# Altium project UPDATE.PrjPcb
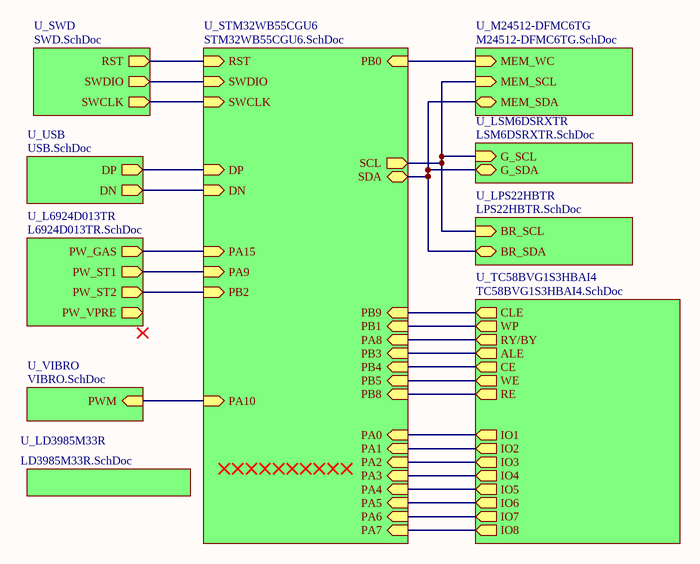
[diagram p0: Device.SchDoc]
11 sheets, 68 parts. Net scope: hierarchical (ports join the sheet entries above them; power ports are global).
Board files: Device.PcbDoc, PCBVer2.PcbDoc, PCBVer3.PcbDoc, PCBVer4.PcbDoc
Sheets:
  Device.SchDoc
    U_STM32WB55CGU6 = STM32WB55CGU6.SchDoc
    U_USB = USB.SchDoc
    U_L6924D013TR = L6924D013TR.SchDoc
    U_M24512-DFMC6TG = M24512-DFMC6TG.SchDoc
    U_LSM6DSRXTR = LSM6DSRXTR.SchDoc
    U_LPS22HBTR = LPS22HBTR.SchDoc
    U_VIBRO = VIBRO.SchDoc
    U_LD3985M33R = LD3985M33R.SchDoc
    U_TC58BVG1S3HBAI4 = TC58BVG1S3HBAI4.SchDoc
    U_SWD = SWD.SchDoc

## Sheet Device.SchDoc
size A4; SheetNumber: 1; SheetTotal: 11

### Sub-sheets
U_L6924D013TR = L6924D013TR.SchDoc: PW_GAS (out), PW_ST1 (out), PW_ST2 (out), PW_VPRE (out)
U_LD3985M33R = LD3985M33R.SchDoc: no entries
U_LPS22HBTR = LPS22HBTR.SchDoc: BR_SCL (in), BR_SDA (bidir)
U_LSM6DSRXTR = LSM6DSRXTR.SchDoc: G_SCL (in), G_SDA (bidir)
U_M24512-DFMC6TG = M24512-DFMC6TG.SchDoc: MEM_SDA (bidir), MEM_SCL (in), MEM_WC (in)
U_STM32WB55CGU6 = STM32WB55CGU6.SchDoc: SCL (out), SDA (bidir), DP (in), DN (in), RST (in), SWDIO (in), SWCLK (in), PA0 (in), PA1 (in), PA15 (in), PA7 (in), PB4 (in), PB3 (in), PA4 (in), PA5 (in), PA10 (in), PA6 (in), PA2 (in), PA3 (in), PB8 (in), PB9 (in), PB5 (in), PB1 (in), PB0 (in), PA8 (in), PA9 (in), PB2 (in)
U_SWD = SWD.SchDoc: RST (out), SWDIO (out), SWCLK (out)
U_TC58BVG1S3HBAI4 = TC58BVG1S3HBAI4.SchDoc: WP (out), ALE (out), CE (out), WE (out), RY/BY (out), RE (out), CLE (out), IO2 (out), IO3 (out), IO4 (out), IO5 (out), IO6 (out), IO7 (out), IO8 (out), IO1 (out)
U_USB = USB.SchDoc: DP (out), DN (out)
U_VIBRO = VIBRO.SchDoc: PWM (in)

### Nets
Net*_2: sheet U_STM32WB55CGU6/SWDIO, sheet U_SWD/SWDIO
Net*_3: sheet U_STM32WB55CGU6/SWCLK, sheet U_SWD/SWCLK
Net*_4: sheet U_STM32WB55CGU6/RST, sheet U_SWD/RST
NetC244_2: sheet U_STM32WB55CGU6/PA8, sheet U_TC58BVG1S3HBAI4/RY/BY
NetD1_1: sheet U_STM32WB55CGU6/PB2, sheet U_L6924D013TR/PW_ST2
NetD2_1: sheet U_STM32WB55CGU6/PA9, sheet U_L6924D013TR/PW_ST1
NetD44_1: sheet U_STM32WB55CGU6/DN, sheet U_USB/DN
NetD44_3: sheet U_STM32WB55CGU6/DP, sheet U_USB/DP
NetIC22_C3: sheet U_STM32WB55CGU6/PB1, sheet U_TC58BVG1S3HBAI4/WP
NetIC22_C4: sheet U_STM32WB55CGU6/PB3, sheet U_TC58BVG1S3HBAI4/ALE
NetIC22_C6: sheet U_STM32WB55CGU6/PB4, sheet U_TC58BVG1S3HBAI4/CE
NetIC22_C7: sheet U_STM32WB55CGU6/PB5, sheet U_TC58BVG1S3HBAI4/WE
NetIC22_D4: sheet U_STM32WB55CGU6/PB8, sheet U_TC58BVG1S3HBAI4/RE
NetIC22_D5: sheet U_STM32WB55CGU6/PB9, sheet U_TC58BVG1S3HBAI4/CLE
NetIC22_H4: sheet U_STM32WB55CGU6/PA0, sheet U_TC58BVG1S3HBAI4/IO1
NetIC22_J4: sheet U_STM32WB55CGU6/PA1, sheet U_TC58BVG1S3HBAI4/IO2
NetIC22_J7: sheet U_STM32WB55CGU6/PA5, sheet U_TC58BVG1S3HBAI4/IO6
NetIC22_J8: sheet U_STM32WB55CGU6/PA7, sheet U_TC58BVG1S3HBAI4/IO8
NetIC22_K4: sheet U_STM32WB55CGU6/PA2, sheet U_TC58BVG1S3HBAI4/IO3
NetIC22_K5: sheet U_STM32WB55CGU6/PA3, sheet U_TC58BVG1S3HBAI4/IO4
NetIC22_K6: sheet U_STM32WB55CGU6/PA4, sheet U_TC58BVG1S3HBAI4/IO5
NetIC22_K7: sheet U_STM32WB55CGU6/PA6, sheet U_TC58BVG1S3HBAI4/IO7
NetR2_1: sheet U_STM32WB55CGU6/PA15, sheet U_L6924D013TR/PW_GAS
NetR12_2: sheet U_STM32WB55CGU6/PA10, sheet U_VIBRO/PWM
NetR15_1: sheet U_STM32WB55CGU6/SCL, sheet U_M24512-DFMC6TG/MEM_SCL, sheet U_LSM6DSRXTR/G_SCL, sheet U_LPS22HBTR/BR_SCL
NetR16_1: sheet U_STM32WB55CGU6/SDA, sheet U_M24512-DFMC6TG/MEM_SDA, sheet U_LSM6DSRXTR/G_SDA, sheet U_LPS22HBTR/BR_SDA
NetU2_7: sheet U_STM32WB55CGU6/PB0, sheet U_M24512-DFMC6TG/MEM_WC

## Sheet STM32WB55CGU6.SchDoc
size A4; SheetNumber: 7; SheetTotal: 11
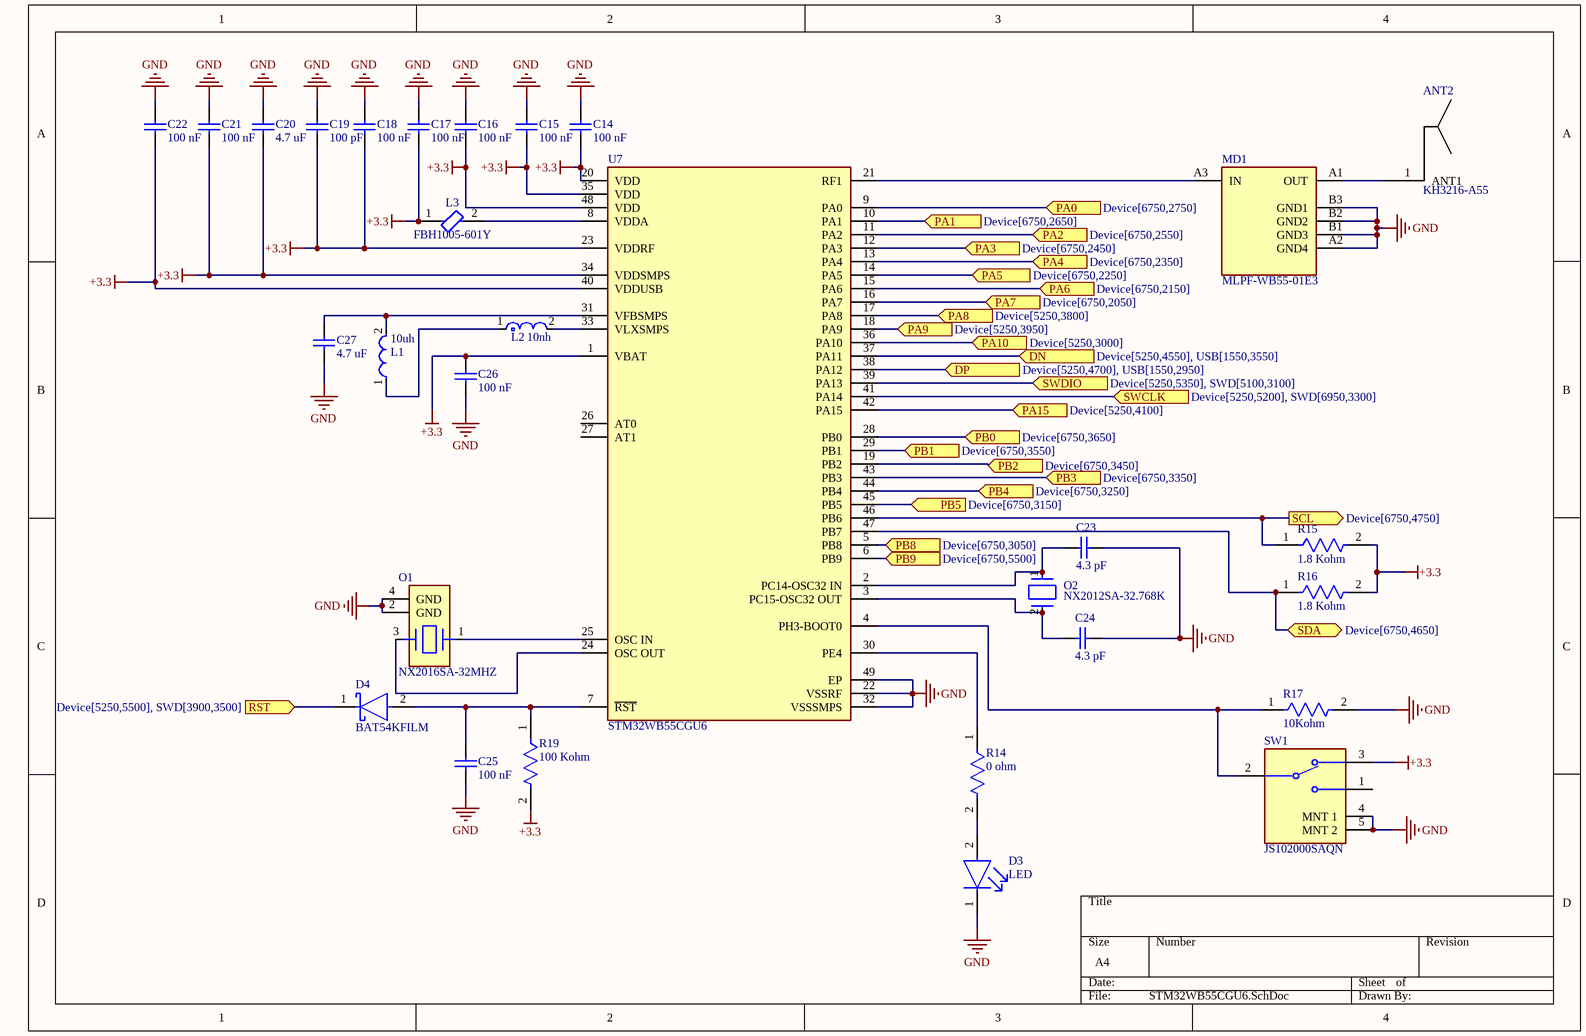
[diagram p1: STM32WB55CGU6.SchDoc]

### Parts
10uh  L1  [FP-LQW15DN_00-MFG]
ANT2  KH3216-A55  [KH3216-A55]
C14  100 nF  [CAPC1005X55X25NL05T10]
C15  100 nF  [CAPC1005X55X25NL05T10]
C16  100 nF  [CAPC1005X55X25NL05T10]
C17  100 nF  [CAPC1005X55X25NL05T10]
C18  100 nF  [CAPC1005X55X25NL05T10]
C19  100 pF  [CAPC1005X55X25NL05T10]
C20  4.7 uF  [CAPC1005X55X25NL05T10]
C21  100 nF  [CAPC1005X55X25NL05T10]
C22  100 nF  [CAPC1005X55X25NL05T10]
C23  4.3 pF  [CAPC1005X55X25NL05T10]
C24  4.3 pF  [CAPC1005X55X25NL05T10]
C25  100 nF  [CAPC1005X55X25NL05T10]
C26  100 nF  [CAPC1005X55X25NL05T10]
C27  4.7 uF  [CAPC1005X55X25NL05T10]
D3  LED  [FP-SML-P11MTT86-MFG]
D4  BAT54KFILM  [FP-SOD-523-MFG]
L2  10nh  [FP-LQG15WH_02-MFG]
L3  FBH1005-601Y  [FP-BLM15-0_05-MFG]
MD1  MLPF-WB55-01E3  [FP-MLPF-WB55-01E3-MFG]
O1  NX2016SA-32MHZ  [FP-NX2016SA-MFG]
O2  NX2012SA-32.768K  [FP-NX2012SA-MFG]
R14  0 ohm  [FP-RC1005-IPC_C]
R15  1.8 Kohm  [FP-RC1005-IPC_C]
R16  1.8 Kohm  [FP-RC1005-IPC_C]
R17  10Kohm  [FP-RC1005-IPC_C]
R19  100 Kohm  [FP-RC1005-IPC_C]
SW1  JS102000SAQN  [FP-JS102000SAQN-MFG]
U7  STM32WB55CGU6  [FP-STM32WB55CGU6-MFG]

### Ports
DN (in, see Device[5250,4550], USB[1550,3550]), DP (in, see Device[5250,4700], USB[1550,2950]), PA0 (in, see Device[6750,2750]), PA1 (in, see Device[6750,2650]), PA2 (in, see Device[6750,2550]), PA3 (in, see Device[6750,2450]), PA4 (in, see Device[6750,2350]), PA5 (in, see Device[6750,2250]), PA6 (in, see Device[6750,2150]), PA7 (in, see Device[6750,2050]), PA8 (in, see Device[5250,3800]), PA9 (in, see Device[5250,3950]), PA10 (in, see Device[5250,3000]), PA15 (in, see Device[5250,4100]), PB0 (in, see Device[6750,3650]), PB1 (in, see Device[6750,3550]), PB2 (in, see Device[6750,3450]), PB3 (in, see Device[6750,3350]), PB4 (in, see Device[6750,3250]), PB5 (in, see Device[6750,3150]), PB8 (in, see Device[6750,3050]), PB9 (in, see Device[6750,5500]), RST (in, see Device[5250,5500], SWD[3900,3500]), SCL (out, see Device[6750,4750]), SDA (bidir, see Device[6750,4650]), SWCLK (in, see Device[5250,5200], SWD[6950,3300]), SWDIO (in, see Device[5250,5350], SWD[5100,3100])

### Nets
+3.3: C14.1 C15.2 C16.1 C17.2 C18.1 C19.2 C20.2 C21.1 C22.2 C26.2 L3.1 R15.2 R16.2 R19.2 SW1.3 U7.1(VBAT) U7.20(VDD) U7.23(VDDRF) U7.34(VDDSMPS) U7.35(VDD) U7.40(VDDUSB) U7.48(VDD)
GND: C14.2 C15.1 C16.2 C17.1 C18.2 C19.1 C20.1 C21.2 C22.1 C23.2 C24.1 C25.1 C26.1 C27.2 D3.1(C) MD1.A2(GND4) MD1.B1(GND3) MD1.B2(GND2) MD1.B3(GND1) O1.2(GND) O1.4(GND) R17.2 SW1.4(MNT_1) SW1.5(MNT_2) U7.22(VSSRF) U7.32(VSSSMPS) U7.49(EP)
Net10uh_1: 10uh.1 L2.1
Net10uh_2: 10uh.2 C27.1 U7.31(VFBSMPS)
Net*_2: U7.39(PA13) ; port SWDIO
Net*_3: U7.41(PA14) ; port SWCLK
Net*_4: D4.1(C) ; port RST
NetANT2_1: ANT2.1(ANT1) MD1.A1(OUT)
NetC23_1: C23.1 O2.1 U7.2(PC14-OSC32_IN)
NetC24_2: C24.2 O2.2 U7.3(PC15-OSC32_OUT)
NetC25_2: C25.2 D4.2(A) R19.1 U7.7(~{RST})
NetC244_2: U7.17(PA8) ; port PA8
NetD1_1: U7.19(PB2) ; port PB2
NetD2_1: U7.18(PA9) ; port PA9
NetD3_2: D3.2(A) R14.2
NetD44_1: U7.37(PA11) ; port DN
NetD44_3: U7.38(PA12) ; port DP
NetIC22_C3: U7.29(PB1) ; port PB1
NetIC22_C4: U7.43(PB3) ; port PB3
NetIC22_C6: U7.44(PB4) ; port PB4
NetIC22_C7: U7.45(PB5) ; port PB5
NetIC22_D4: U7.5(PB8) ; port PB8
NetIC22_D5: U7.6(PB9) ; port PB9
NetIC22_H4: U7.9(PA0) ; port PA0
NetIC22_J4: U7.10(PA1) ; port PA1
NetIC22_J7: U7.14(PA5) ; port PA5
NetIC22_J8: U7.16(PA7) ; port PA7
NetIC22_K4: U7.11(PA2) ; port PA2
NetIC22_K5: U7.12(PA3) ; port PA3
NetIC22_K6: U7.13(PA4) ; port PA4
NetIC22_K7: U7.15(PA6) ; port PA6
NetL2_2: L2.2 U7.33(VLXSMPS)
NetL3_2: L3.2 U7.8(VDDA)
NetMD1_A3: MD1.A3(IN) U7.21(RF1)
NetO1_1: O1.1 U7.25(OSC_IN)
NetO1_3: O1.3 U7.24(OSC_OUT)
NetR2_1: U7.42(PA15) ; port PA15
NetR12_2: U7.36(PA10) ; port PA10
NetR14_1: R14.1 U7.30(PE4)
NetR15_1: R15.1 U7.46(PB6) ; port SCL
NetR16_1: R16.1 U7.47(PB7) ; port SDA
NetR17_1: R17.1 SW1.2(C) U7.4(PH3-BOOT0)
NetU2_7: U7.28(PB0) ; port PB0

Not connected (* = marked no-connect by the designer): SW1 1; U7 26(AT0) 27(AT1)

### Library data of the parts
10uh = CMP-06042-016523-1: FIXED IND 10UH 120MA 5.405OHM; RoHS Compliant: Yes
C14-C27 = CMP-2008-04515-1: Manufacturer: Murata; Part Number: GRM155F50J684ZE01D
D3 = CMP-2000-07126-2: LED YELLOW/GREEN CLEAR 1006 SMD; Forward Current: 20mA; Lens Color: Colorless; Power Rating: 54mW; Lens Style: Diffused; Wavelength: 569nm; Viewing Angle: 150°; Number of LEDs: 1; Test Current: 1mA; Luminous Intensity: 2.1mcd; Illumination Color: Green; Forward Voltage: 1.9V; REACH SVHC: No SVHC; Mount: Surface Mount; Series: PicoLED™; Case Code (Imperial): 0402; Min Operating Temperature: -40°C; Max Operating Temperature: 85°C; Number of Pins: 2; Package Quantity: 1; Height: 0.25mm; Lens Transparency: Clear; Case Code (Metric): 1005; Packaging: Tape and Reel; Width: 0.6mm; Radiation Hardening: No; Case/Package: 0402; Lead Free: Lead Free; Color: Green; RoHS Compliant: Yes; Length: 1mm; Dominant Wavelength: 569nm
D4 = CMP-12187-000026-1: DIODE SCHOTTKY 40V 300MA SOD523; Manufacturer: STMicroelectronics; Capacitance: 7pF; Value: 7pF; Max Surge Forward Current: 1.25A; Peak Reverse Current: 1uA; Max Junction Temp: +150°C; Device Class L2: Diodes; Temperature Range Low: -40°C; Category: Diode; Manufacturer Part Number: BAT54KFILM; Digikey Description: DIODE SCHOTTKY 40V 300MA SOD523; Device Class L3: Schottky Diodes; Automotive: No; Height: 0.7mm; Octopart: https://octopart.com/bat54kfilm-stmicroelectronics-39618022; ComponentLink2Description: Datasheet; Temperature Range High: +150°C; Device Class L1: Discrete Semiconductors; Max Repetitive Reverse Voltage: 40V; RoHS: TRUE; Temperature: -40°C to +150°C; ComponentLink2URL: https://www.st.com/content/ccc/resource/technical/document/datasheet/07/50/54/f2/0d/ba/4a/79/CD00001322.pdf/files/CD00001322.pdf/jcr:content/translations/en.CD00001322.pdf; Lead Free: Yes; Forward Current: 300mA; Package: SOD-523; Mouser Description: Schottky Diodes & Rectifiers schottky diode
L2 = CMP-06042-005237-1: Multilayer type Inductor for Automotive 10nH ±5% 0.19Ω 500mA 0402; Core Material: Air; Test Frequency: 100MHz; DC Resistance (DCR): 190mR; Shielding: Unshielded; Self Resonant Frequency: 3.3GHz; Min Operating Temperature: -55°C; Tolerance: 5%; Inductance: 10nH; Max Operating Temperature: 125°C; Packaging: Cut Tape; Current Rating: 500mA; Case Code (Metric): 1005; Mount: Surface Mount; Case/Package: 0402; Ratings: AEC-Q200; Case Code (Imperial): 0402
L3 = CMP-0686-00187-4: Chip Ferrite Bead, 0402, 600Ω @ 100MHz, 0.52Ω, 25%, 300mA; DC Resistance-Max: 600mR; Number of Lines: 1; DC Resistance (DCR): 520mR; Shielding: Unshielded; Impedance: 600R; Material: Steel; Frequency: 100MHz; Lead Free: Lead Free; Max DC Current: 300mA; Test Frequency: 100MHz; Depth: 0.55mm; Length: 1mm; Case Code (Imperial): 0402; Packaging: Tape and Reel; Height: 0.5mm; Max Operating Temperature: 125°C; Military Standard: Not; REACH SVHC: No SVHC; Case Code (Metric): 1005; Series: BLM15AG_SN; Core Material: Ferrite; Termination: SMD/SMT; DC Current: 300mA; Package Quantity: 10000; Width: 0.5mm; RoHS Compliant: Yes; Min Operating Temperature: -55°C; Current Rating: 300mA; Case/Package: 0402; Number of Pins: 2; Radiation Hardening: No; Tolerance: 25%; Number of Circuits: 1; Max Current Rating: 300mA
MD1 = CMP-12074-000002-1: RF FILTER LOW PASS 2.45GHZ 6SMD
O1 = CMP-200220-000017-1: CRYSTAL 32.0000MHZ 8PF SMD; Frequency: 32MHz; ESR (Equivalent Series Resistance): 60R; Ratings: AEC-Q200; Mount: Surface Mount; Case/Package: SMD/SMT; Packaging: Tape and Reel; Load Capacitance: 8pF; Min Operating Temperature: -40°C; Max Operating Temperature: 125°C
O2 = CMP-200220-000019-1: CRYSTAL 32.7680KHZ 12.5PF SMD; Frequency Tolerance: 20ppm; ESR (Equivalent Series Resistance): 80kR; Frequency: 32.768kHz; Mount: Surface Mount; Packaging: Cut Tape; Min Operating Temperature: -40°C; Max Operating Temperature: 85°C; Case/Package: SMD/SMT; RoHS Compliant: Yes; Length: 0.081inch; Series: NX2012SA; Height: 0.024inch; Width: 0.047inch; Load Capacitance: 12.5pF
R14-R17 R19 = CMP-13261-000953-1: Res Thick Film 0402 1.87kΩ 1% 0.063W ±100ppm/°C Molded SMD T/R; Power Rating: 63mW; Voltage Rating (DC): 50V; Resistance: 1.87kR; Tolerance: 1%; Height: 0.016inch; Length: 1mm; Case Code (Metric): 1005; Width: 0.02inch; Max Power Dissipation: 63mW; Radiation Hardening: No; Features: Moisture Resistant; Temperature Coefficient: 100ppm/°C; Min Operating Temperature: -55°C; Number of Terminations: 2; Max Operating Temperature: 155°C; Case Code (Imperial): 0402; Composition: Thick Film; Depth: 0.5mm; Lead Free: Lead Free; Package Quantity: 1; Case/Package: 0402; Packaging: Tape and Reel; Contact Plating: Tin; Military Standard: Not
SW1 = CMP-10038-000025-1: SWITCH SLIDE SPDT 1MA 5V; Actuator Material: Nylon; Contact Resistance: 70mR; Electrical Life: 15000Cycles; Actuator Length: 1.5mm; Switch Function: On-On; Actuator Type: Standard; Actuator Color: Black; Current Rating: 1mA; Throw Configuration: SPDT; Termination: Gull Wing; Housing Material: Nylon; Max Operating Temperature: 85°C; Max Voltage Rating (DC): 5V; Voltage Rating (DC): 5V; Contact Plating: Silver; Radiation Hardening: No; Package Quantity: 1; REACH SVHC: No SVHC; RoHS Compliant: Yes; Orientation: Right Angle; Max Current Rating: 1mA; Case/Package: SMD/SMT; Contact Current Rating: 1mA; Contact Material: Copper Alloy; Mount: Surface Mount; Flammability Rating: UL94 V-2; Packaging: Tape and Reel; Switch Travel: 1.5mm; Length: 7.8mm; Series: JS; Min Operating Temperature: -20°C; Depth: 4.82mm
U7 = CMP-12105-000013-1: ULTRA-LOW-POWER DUAL CORE ARM CO; Manufacturer: STMicroelectronics; Number Of Cores: 1; Number Of I2C Channels: 2; Interface: I2C,SPI,UART,USART,2-Wire,USB,IrDA,Other; Core Architecture: ARM Cortex-M4; Data Bus Width: 32bits; Memory Size: 1MBytes; Number Of Pwm Channels: 14; Max Supply Voltage: 3.6V; Standoff Height: 0mm; Number Of Timers/Counters: 6; Frequency: 64MHz; Max Junction Temp: +105°C; Number Of I/Os: 30; Min Supply Voltage: 1.71V; Number Of Adc Channels: 13; Ram Size: 256KBytes; Memory Type: FLASH; Octopart: https://octopart.com/stm32wb55cgu6-stmicroelectronics-98750847; Temperature Range High: +105°C; RoHS: TRUE; Number Of Spi Channels: 1; Category: IC; Device Class L1: Integrated Circuits (ICs); Lead Free: Yes; Height: 0.65mm; Number Of A/D Converters: 1; Package: UFQFPN48; Number Of Usb Channels: 1; Number Of Uart Channels: 2; Temperature Range Low: -40°C; Ambient Temperature Range Low: -40°C; Device Class L3: Microcontrollers; Manufacturer Part Number: STM32WB55CGU6; Temperature: -40°C to +105°C; ComponentLink2URL: https://www.st.com/resource/en/datasheet/stm32wb55cg.pdf; Device Class L2: Embedded Processors and Controllers; Digikey Description: ULTRA-LOW-POWER DUAL CORE ARM CO; ComponentLink2Description: Datasheet; Ambient Temperature Range High: +85°C; Automotive: No

## Sheet USB.SchDoc
size A4; SheetNumber: 9; SheetTotal: 11
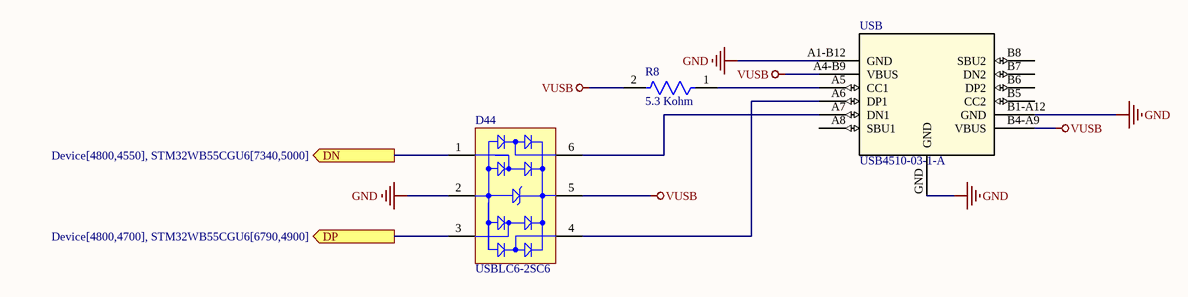
[diagram p2: USB.SchDoc]

### Parts
D44  USBLC6-2SC6  [STM-SOT23-6L_V]
R8  5.3 Kohm  [FP-RC1005-IPC_C]
USB  USB4510-03-1-A  [USB4510-03-1-A]

### Ports
DN (out, see Device[4800,4550], STM32WB55CGU6[7340,5000]), DP (out, see Device[4800,4700], STM32WB55CGU6[6790,4900])

### Nets
GND: D44.2(GND) USB.A1-B12(GND) USB.B1-A12(GND) USB.GND
VUSB: D44.5(VBUS) R8.2 USB.A4-B9(VBUS) USB.B4-A9(VBUS)
NetD44_1: D44.1(I/O_1) ; port DN
NetD44_3: D44.3(I/O_2) ; port DP
NetD44_4: D44.4(I/O_3) USB.A6(DP1)
NetD44_6: D44.6(I/O_4) USB.A7(DN1)
NetR8_1: R8.1 USB.A5(CC1)

Not connected (* = marked no-connect by the designer): USB A8(SBU1) B5(CC2) B6(DP2) B7(DN2) B8(SBU2)

### Library data of the parts
D44 = CMP-2000-05378-1: Very low capacitance ESD protection, 3.5 pF, -40 to 125 degC, 6-Pin SOT23, RoHS, Tape and Reel; Manufacturer: STMicroelectronics; Polarity: Uni-Directional; Clamping Voltage: 17V; Rad Hardened: No; Product Height (mm): 1.3mm; Leakage Current (Max): 0.15uA; Product Length (mm): 3.05mm; Number of Elements: 1; Peak Pulse Current: 5A; Configuration: Dual; Reverse Breakdown Voltage: 6V; Working Voltage (Max): 5V; Capacitance Value: 3.5pF; Suppressor Type: DiodeArrays; Product Depth (mm): 1.75mm; Test Current (It): 1mA; Package / Case: SOT-23; Operating Temperature Max Deg. C: 125C; Package Description: 6-Pin Small Outline Transistor, Body 2.925 x 1.625 mm, Pitch 0.95 mm; Package Reference: SOT23-6L; Datasheet Version: Rev. 5, 10/2011; Operating Temperature Min Deg. C: -40C; Mounting Style: SurfaceMount; Direction Type: Uni-Directional; Mounting: SurfaceMount; Pin Count: 6; Leakage Current: 0.15uA; Packaging: TapeandReel; Operating Temperature Classification: Automotive; Clamping Voltage (Max): 17V; Manufacturer URL: http://www.st.com/; Reverse Stand-off Voltage: 5V; Datasheet URL: http://www.st.com/st-web-ui/static/active/en/resource/technical/document/datasheet/CD00050750.pdf; Working Voltage: 5V; Operating Temp Range: -40Cto125C
R8 = CMP-13261-000953-1: as R14 on sheet STM32WB55CGU6; Tolerance: 1%; Height: 0.016inch; Length: 1mm; Case Code (Metric): 1005; Width: 0.02inch; Max Power Dissipation: 63mW; Radiation Hardening: No; Features: Moisture Resistant; Temperature Coefficient: 100ppm/°C; Min Operating Temperature: -55°C; Number of Terminations: 2; Max Operating Temperature: 155°C; Case Code (Imperial): 0402; Composition: Thick Film; Depth: 0.5mm; Lead Free: Lead Free; Package Quantity: 1; Case/Package: 0402; Packaging: Tape and Reel; Contact Plating: Tin; Military Standard: Not

## Sheet L6924D013TR.SchDoc
size A4; SheetNumber: 2; SheetTotal: 11
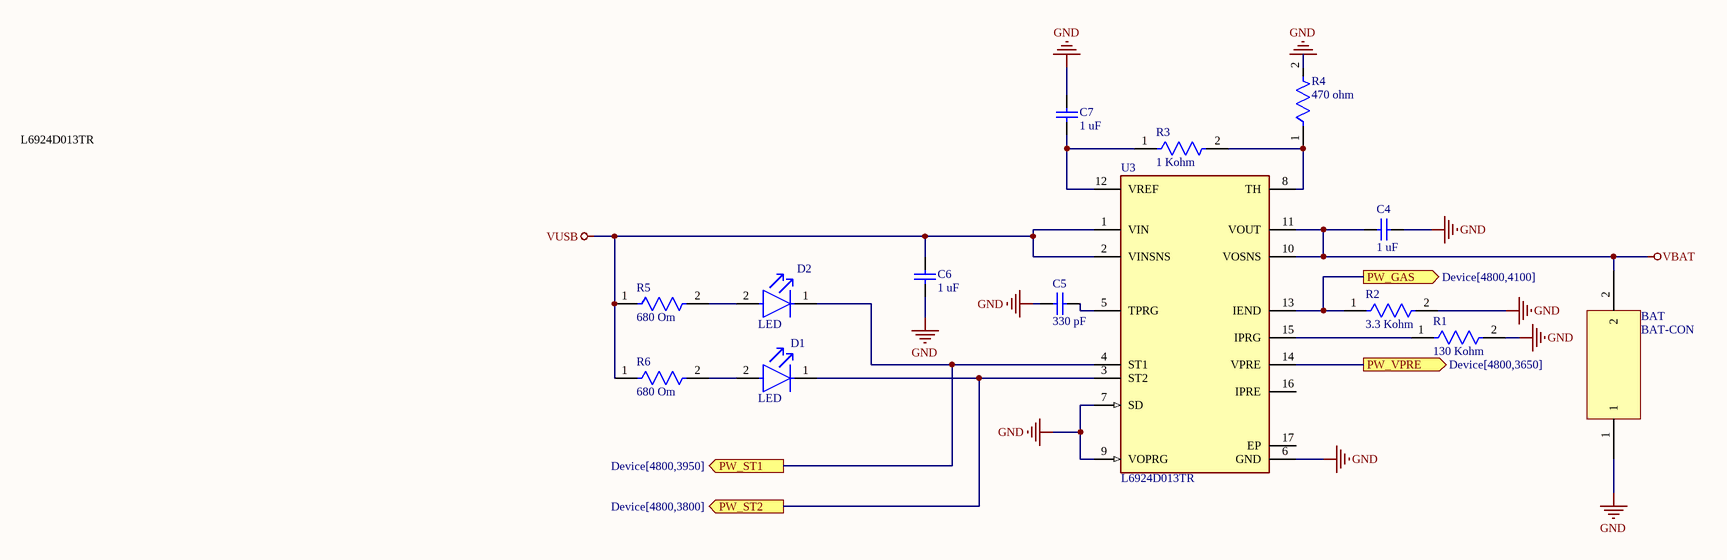
[diagram p3: L6924D013TR.SchDoc]

### Parts
BAT  BAT-CON  [BAT-CON]
C4  1 uF  [CAPC1005X55X25NL05T10]
C5  330 pF  [CAPC1005X55X25NL05T10]
C6  1 uF  [CAPC1005X55X25NL05T10]
C7  1 uF  [CAPC1005X55X25NL05T10]
D1  LED  [FP-SML-P11MTT86-MFG]
D2  LED  [FP-SML-P11MTT86-MFG]
R1  130 Kohm  [FP-RC1005-IPC_C]
R2  3.3 Kohm  [FP-RC1005-IPC_C]
R3  1 Kohm  [FP-RC1005-IPC_C]
R4  470 ohm  [FP-RC1005-IPC_C]
R5  680 Om  [FP-RC1005-IPC_C]
R6  680 Om  [FP-RC1005-IPC_C]
U3  L6924D013TR  [FP-VFQFPN16-7185330-MFG]

### Ports
PW_GAS (out, see Device[4800,4100]), PW_ST1 (out, see Device[4800,3950]), PW_ST2 (out, see Device[4800,3800]), PW_VPRE (out, see Device[4800,3650])

### Nets
GND: BAT.1 C4.1 C5.2 C6.2 C7.1 R1.2 R2.2 R4.2 U3.6(GND) U3.7(SD) U3.9(VOPRG)
VBAT: BAT.2 C4.2 U3.10(VOSNS) U3.11(VOUT)
VUSB: C6.1 R5.1 R6.1 U3.1(VIN) U3.2(VINSNS)
NetC5_1: C5.1 U3.5(TPRG)
NetC7_2: C7.2 R3.1 U3.12(VREF)
NetD1_1: D1.1(C) U3.3(ST2) ; port PW_ST2
NetD1_2: D1.2(A) R6.2
NetD2_1: D2.1(C) U3.4(ST1) ; port PW_ST1
NetD2_2: D2.2(A) R5.2
NetR1_1: R1.1 U3.15(IPRG)
NetR2_1: R2.1 U3.13(IEND) ; port PW_GAS
NetR3_2: R3.2 R4.1 U3.8(TH)
NetU3_14: U3.14(VPRE) ; port PW_VPRE

Not connected (* = marked no-connect by the designer): U3 16(IPRE) 17(EP)

### Notes on the sheet
- L6924D013TR

### Library data of the parts
C4-C7 = CMP-2008-04515-1: as C14 on sheet STM32WB55CGU6
D1 D2 = CMP-2000-07126-2: as D3 on sheet STM32WB55CGU6; REACH SVHC: No SVHC; Mount: Surface Mount; Series: PicoLED™; Case Code (Imperial): 0402; Min Operating Temperature: -40°C; Max Operating Temperature: 85°C; Number of Pins: 2; Package Quantity: 1; Height: 0.25mm; Lens Transparency: Clear; Case Code (Metric): 1005; Packaging: Tape and Reel; Width: 0.6mm; Radiation Hardening: No; Case/Package: 0402; Lead Free: Lead Free; Color: Green; RoHS Compliant: Yes; Length: 1mm; Dominant Wavelength: 569nm
R1-R6 = CMP-13261-000953-1: as R14 on sheet STM32WB55CGU6; Tolerance: 1%; Height: 0.016inch; Length: 1mm; Case Code (Metric): 1005; Width: 0.02inch; Max Power Dissipation: 63mW; Radiation Hardening: No; Features: Moisture Resistant; Temperature Coefficient: 100ppm/°C; Min Operating Temperature: -55°C; Number of Terminations: 2; Max Operating Temperature: 155°C; Case Code (Imperial): 0402; Composition: Thick Film; Depth: 0.5mm; Lead Free: Lead Free; Package Quantity: 1; Case/Package: 0402; Packaging: Tape and Reel; Contact Plating: Tin; Military Standard: Not
U3 = CMP-12147-000005-1: IC BATT CHRGR ION/POLY 16-VFQFPN; Manufacturer: STMicroelectronics; Output Current: 975mA; Number Of Cells: 1; Standoff Height: 0.02mm; Max Junction Temp: +125°C; Max Supply Voltage: 12V; Nominal Supply Current: 1.8mA; Max Power Dissipation: 0.67W; Min Supply Voltage: 2.5V; Output Voltage: 4.2V; Automotive: No; Manufacturer Part Number: L6924D013TR; Digikey Description: IC BATT CHRGR ION/POLY 16-VFQFPN; ComponentLink2Description: Datasheet; Footprint Url: https://www.st.com/resource/en/datasheet/l6738.pdf; Device Class L2: Power Management ICs; Package: VFQFPN16-7185330; Temperature Range High: +125°C; Mouser Description: Battery Management Battery Charger Sys Li-Ion/Li-Poly; Number Of Outputs: 1; Lead Free: Yes; Device Class L3: Battery Management; Category: IC; Temperature: -40°C to +125°C; Temperature Range Low: -40°C; Octopart: https://octopart.com/l6924d013tr-stmicroelectronics-421996; ComponentLink2URL: https://www.st.com/resource/en/datasheet/l6924d.pdf; Device Class L1: Integrated Circuits (ICs); Height: 1mm; Ipc Land Pattern Name: QFN50P300X300X90-16; RoHS: TRUE

## Sheet M24512-DFMC6TG.SchDoc
size A4; SheetNumber: 6; SheetTotal: 11
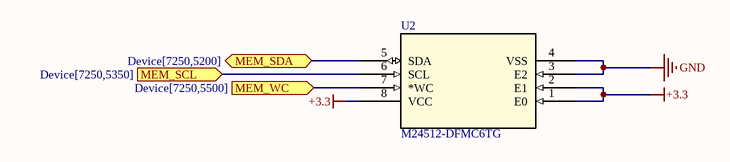
[diagram p4: M24512-DFMC6TG.SchDoc]

### Parts
U2  M24512-DFMC6TG  [M24512-DFMC6TG]

### Ports
MEM_SCL (in, see Device[7250,5350]), MEM_SDA (bidir, see Device[7250,5200]), MEM_WC (in, see Device[7250,5500])

### Nets
+3.3: U2.1(E0) U2.2(E1) U2.8(VCC)
GND: U2.3(E2) U2.4(VSS)
NetR15_1: U2.6(SCL) ; port MEM_SCL
NetR16_1: U2.5(SDA) ; port MEM_SDA
NetU2_7: U2.7(*WC) ; port MEM_WC

## Sheet LSM6DSRXTR.SchDoc
size A4; SheetNumber: 5; SheetTotal: 11
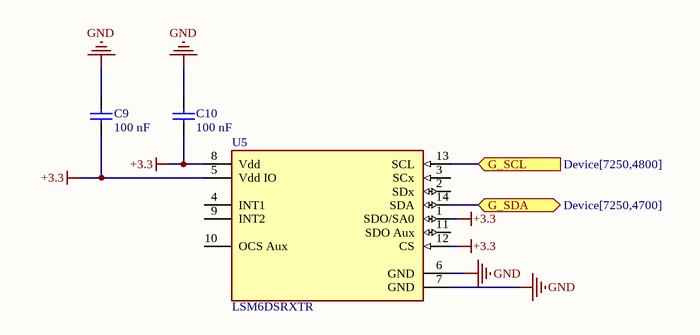
[diagram p5: LSM6DSRXTR.SchDoc]

### Parts
C9  100 nF  [CAPC1005X55X25NL05T10]
C10  100 nF  [CAPC1005X55X25NL05T10]
U5  LSM6DSRXTR  [FP-LGA-14L-DM00249496-MFG]

### Ports
G_SCL (in, see Device[7250,4800]), G_SDA (bidir, see Device[7250,4700])

### Nets
+3.3: C9.2 C10.2 U5.1(SDO/SA0) U5.5(Vdd_IO) U5.8(Vdd) U5.12(CS)
GND: C9.1 C10.1 U5.6(GND) U5.7(GND)
NetR15_1: U5.13(SCL) ; port G_SCL
NetR16_1: U5.14(SDA) ; port G_SDA

Not connected (* = marked no-connect by the designer): U5 2(SDx) 3(SCx) 4(INT1) 9(INT2) 10(OCS_Aux) 11(SDO_Aux)

### Library data of the parts
C9 C10 = CMP-2008-04515-1: as C14 on sheet STM32WB55CGU6
U5 = CMP-12177-000016-1: CONSUMER MEMS; RoHS Compliant: Yes

## Sheet LPS22HBTR.SchDoc
size A4; SheetNumber: 4; SheetTotal: 11
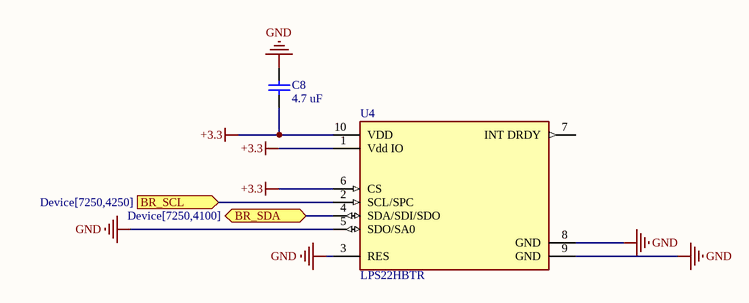
[diagram p6: LPS22HBTR.SchDoc]

### Parts
C8  4.7 uF  [CAPC1005X55X25NL05T10]
U4  LPS22HBTR  [FP-HLGA-10L-8479831-0]

### Ports
BR_SCL (in, see Device[7250,4250]), BR_SDA (bidir, see Device[7250,4100])

### Nets
+3.3: C8.2 U4.1(Vdd_IO) U4.6(CS) U4.10(VDD)
GND: C8.1 U4.3(RES) U4.5(SDO/SA0) U4.8(GND) U4.9(GND)
NetR15_1: U4.2(SCL/SPC) ; port BR_SCL
NetR16_1: U4.4(SDA/SDI/SDO) ; port BR_SDA

Not connected (* = marked no-connect by the designer): U4 7(INT_DRDY)

### Library data of the parts
C8 = CMP-2008-04515-1: as C14 on sheet STM32WB55CGU6
U4 = CMP-12182-000004-1: MEMS NANO PRESSURE SENSOR: 260-1; Manufacturer: STMicroelectronics; Sensor Output: I2C,SPI; Port Style: No Port; Max Supply Voltage: 3.6V; Operating Supply Current: 3-12uA; Min Supply Voltage: 1.7V; Device Class L3: unset; Device Class L1: Sensors; Manufacturer Part Number: LPS22HBTR; Temperature Range High: +85°C; Digikey Description: MEMS NANO PRESSURE SENSOR: 260-1; Device Class L2: Pressure Sensors; RoHS: TRUE; Lead Free: Yes; Height: 0.8mm; Automotive: No; Octopart: https://octopart.com/lps22hbtr-stmicroelectronics-51851131; Package: HLGA-10L-8479831; Temperature Range Low: -40°C; Category: IC; Temperature: -40°C to +85°C; ComponentLink2Description: Datasheet; ComponentLink2URL: https://www.st.com/resource/en/datasheet/lps22hb.pdf; Footprint Url: https://www.st.com/content/ccc/resource/technical/document/technical_note/73/17/9c/16/dd/96/4a/01/CD00134799.pdf/files/CD00134799.pdf/jcr:content/translations/en.CD00134799.pdf

## Sheet VIBRO.SchDoc
size A4; SheetNumber: 10; SheetTotal: 11
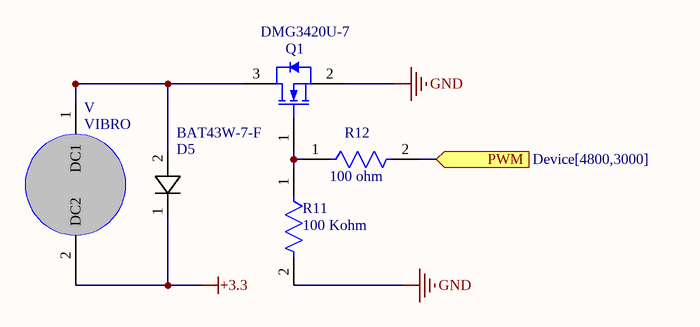
[diagram p7: VIBRO.SchDoc]

### Parts
D5  BAT43W-7-F  [BAT43W-7-F]
Q1  DMG3420U-7  [DIOD-SOT23-3_B_V]
R11  100 Kohm  [FP-RC1005-IPC_C]
R12  100 ohm  [FP-RC1005-IPC_C]
V  VIBRO  [VIBRO]

### Ports
PWM (in, see Device[4800,3000])

### Nets
+3.3: D5.1 V.2(DC2)
GND: Q1.2(S) R11.2
NetD5_2: D5.2 Q1.3(D) V.1(DC1)
NetQ1_1: Q1.1(G) R11.1 R12.1
NetR12_2: R12.2 ; port PWM

### Library data of the parts
Q1 = CMP-2000-06172-1: N-Channel Enhancement Mode MOSFET, 20 V, -55 to 150 degC, 3-Pin SOT23, RoHS, Tape and Reel; Manufacturer: Diodes Inc; Drain-Source On Resistance-Max: 29mO; Qg Gate Charge: 5.4nC; Drain-to-Source Voltage [Vdss]: 20V; Rated Power Dissipation: 740mW; Datasheet URL: http://www.diodes.com/_files/datasheets/ds31867.pdf; Package Description: 3-Pin Small Outline Transistor, Body 2.9 x 1.3 mm, Pitch 0.96 mm; Package Reference: SOT23-3; Datasheet Version: Rev. 5-2, 09/2013; Mounting Technology: SurfaceMount; Channel Type: N-Channel; Manufacturer URL: http://www.diodes.com/
R11 R12 = CMP-13261-000953-1: as R14 on sheet STM32WB55CGU6; Tolerance: 1%; Height: 0.016inch; Length: 1mm; Case Code (Metric): 1005; Width: 0.02inch; Max Power Dissipation: 63mW; Radiation Hardening: No; Features: Moisture Resistant; Temperature Coefficient: 100ppm/°C; Min Operating Temperature: -55°C; Number of Terminations: 2; Max Operating Temperature: 155°C; Case Code (Imperial): 0402; Composition: Thick Film; Depth: 0.5mm; Lead Free: Lead Free; Package Quantity: 1; Case/Package: 0402; Packaging: Tape and Reel; Contact Plating: Tin; Military Standard: Not

## Sheet LD3985M33R.SchDoc
size A4; SheetNumber: 3; SheetTotal: 11
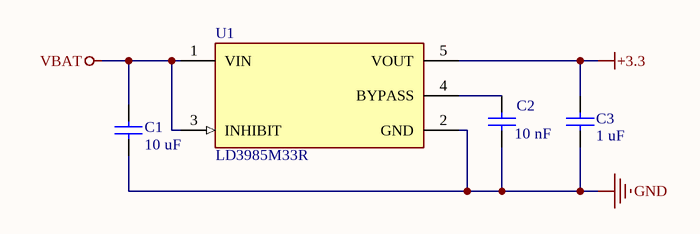
[diagram p8: LD3985M33R.SchDoc]

### Parts
C1  10 uF  [CAPC1005X55X25NL05T10]
C2  10 nF  [CAPC1005X55X25NL05T10]
C3  1 uF  [CAPC1005X55X25NL05T10]
U1  LD3985M33R  [FP-SOT23-5L-7049676-MFG]

### Nets
+3.3: C3.2 U1.5(VOUT)
GND: C1.1 C2.1 C3.1 U1.2(GND)
VBAT: C1.2 U1.1(VIN) U1.3(INHIBIT)
NetC2_2: C2.2 U1.4(BYPASS)

### Library data of the parts
C1-C3 = CMP-2008-04515-1: as C14 on sheet STM32WB55CGU6
U1 = CMP-0244-00328-2: IC REG LINEAR 3.3V 150MA SOT23-5; Input Bias Current: 85uA; Output Type: Fixed; Max Input Voltage: 6V; Min Input Voltage: 2.5V; Output Voltage Accuracy: 2%; Quiescent Current: 150uA; Number of Regulators: 1; Min Current Limit: 300mA; Dropout Voltage: 60mV; Polarity: Positive; Min Operating Temperature: -40°C; Height: 1.3mm; Radiation Hardening: No; Package Quantity: 1; Number of Pins: 5; Output Current: 150mA; Width: 1.75mm; Length: 3mm; Mount: Surface Mount; Case/Package: SOT-23; Lead Free: Lead Free; Number of Outputs: 1; Max Operating Temperature: 125°C; Accuracy: 2%; Max Output Current: 150mA; Packaging: Tape and Reel; Output Voltage: 3.3V; Min Output Voltage: 3.3V

## Sheet TC58BVG1S3HBAI4.SchDoc
size A4; SheetNumber: 11; SheetTotal: 11
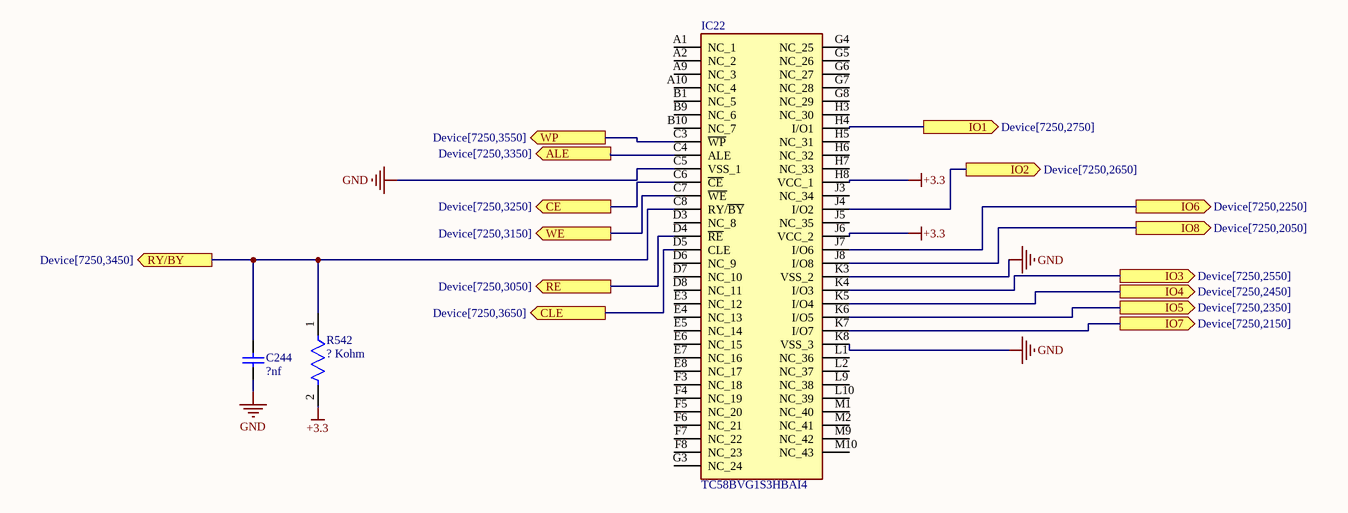
[diagram p9: TC58BVG1S3HBAI4.SchDoc]

### Parts
C244  ?nf  [CAPC1005X55X25NL05T10]
IC22  TC58BVG1S3HBAI4  [BGA63C80P10X12_900X1100X100]
R542  ? Kohm  [FP-RC1005-IPC_C]

### Ports
ALE (out, see Device[7250,3350]), CE (out, see Device[7250,3250]), CLE (out, see Device[7250,3650]), IO1 (out, see Device[7250,2750]), IO2 (out, see Device[7250,2650]), IO3 (out, see Device[7250,2550]), IO4 (out, see Device[7250,2450]), IO5 (out, see Device[7250,2350]), IO6 (out, see Device[7250,2250]), IO7 (out, see Device[7250,2150]), IO8 (out, see Device[7250,2050]), RE (out, see Device[7250,3050]), RY/BY (out, see Device[7250,3450]), WE (out, see Device[7250,3150]), WP (out, see Device[7250,3550])

### Nets
+3.3: IC22.H8(VCC_1) IC22.J6(VCC_2) R542.2
GND: C244.1 IC22.C5(VSS_1) IC22.K3(VSS_2) IC22.K8(VSS_3)
NetC244_2: C244.2 IC22.C8(RY/~{BY}) R542.1 ; port RY/BY
NetIC22_C3: IC22.C3(~{WP}) ; port WP
NetIC22_C4: IC22.C4(ALE) ; port ALE
NetIC22_C6: IC22.C6(~{CE}) ; port CE
NetIC22_C7: IC22.C7(~{WE}) ; port WE
NetIC22_D4: IC22.D4(~{RE}) ; port RE
NetIC22_D5: IC22.D5(CLE) ; port CLE
NetIC22_H4: IC22.H4(I/O1) ; port IO1
NetIC22_J4: IC22.J4(I/O2) ; port IO2
NetIC22_J7: IC22.J7(I/O6) ; port IO6
NetIC22_J8: IC22.J8(I/O8) ; port IO8
NetIC22_K4: IC22.K4(I/O3) ; port IO3
NetIC22_K5: IC22.K5(I/O4) ; port IO4
NetIC22_K6: IC22.K6(I/O5) ; port IO5
NetIC22_K7: IC22.K7(I/O7) ; port IO7

Not connected (* = marked no-connect by the designer): IC22 A1(NC_1) A2(NC_2) A9(NC_3) A10(NC_4) B1(NC_5) B9(NC_6) B10(NC_7) D3(NC_8) D6(NC_9) D7(NC_10) D8(NC_11) E3(NC_12) E4(NC_13) E5(NC_14) E6(NC_15) E7(NC_16) E8(NC_17) F3(NC_18) F4(NC_19) F5(NC_20) F6(NC_21) F7(NC_22) F8(NC_23) G3(NC_24) G4(NC_25) G5(NC_26) G6(NC_27) G7(NC_28) G8(NC_29) H3(NC_30) H5(NC_31) H6(NC_32) H7(NC_33) J3(NC_34) J5(NC_35) L1(NC_36) L2(NC_37) L9(NC_38) L10(NC_39) M1(NC_40) M2(NC_41) M9(NC_42) M10(NC_43)

### Library data of the parts
C244 = CMP-2008-04515-1: as C14 on sheet STM32WB55CGU6
IC22 = TC58BVG1S3HBAI4: Integrated Circuit; Manufacturer_Name: Toshiba; Datasheet Link: https://media.digikey.com/pdf/Data%20Sheets/Toshiba%20PDFs/KIOXIA_TC58BVG1S3HBAI4_REV2.00_E20191001C.pdf; Height: 1mm; Manufacturer_Part_Number: TC58BVG1S3HBAI4; Mouser Part Number: 757-TC58BVG1S3HBAI4; Mouser Price/Stock: https://www.mouser.com/Search/Refine.aspx?Keyword=757-TC58BVG1S3HBAI4
R542 = CMP-13261-000953-1: as R14 on sheet STM32WB55CGU6; Tolerance: 1%; Height: 0.016inch; Length: 1mm; Case Code (Metric): 1005; Width: 0.02inch; Max Power Dissipation: 63mW; Radiation Hardening: No; Features: Moisture Resistant; Temperature Coefficient: 100ppm/°C; Min Operating Temperature: -55°C; Number of Terminations: 2; Max Operating Temperature: 155°C; Case Code (Imperial): 0402; Composition: Thick Film; Depth: 0.5mm; Lead Free: Lead Free; Package Quantity: 1; Case/Package: 0402; Packaging: Tape and Reel; Contact Plating: Tin; Military Standard: Not

## Sheet SWD.SchDoc
size A4; SheetNumber: 8; SheetTotal: 11
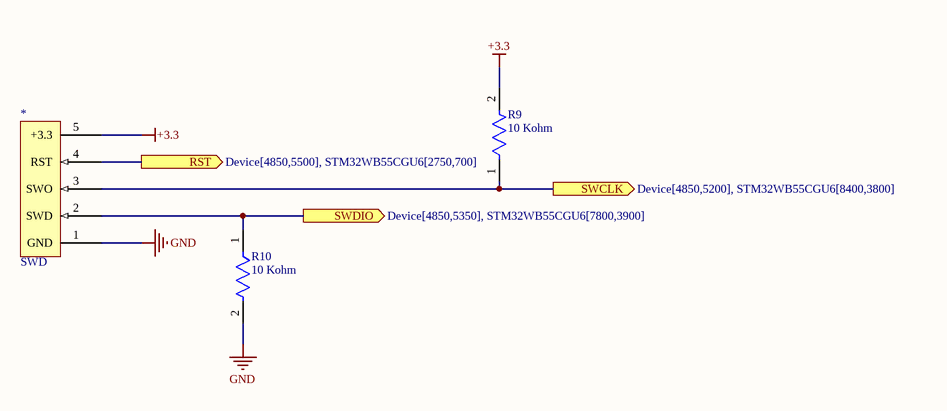
[diagram p10: SWD.SchDoc]

### Parts
*  SWD  [PCBComponent_1]
R9  10 Kohm  [FP-RC1005-IPC_C]
R10  10 Kohm  [FP-RC1005-IPC_C]

### Ports
RST (out, see Device[4850,5500], STM32WB55CGU6[2750,700]), SWCLK (out, see Device[4850,5200], STM32WB55CGU6[8400,3800]), SWDIO (out, see Device[4850,5350], STM32WB55CGU6[7800,3900])

### Nets
+3.3: *.5(+3.3) R9.2
GND: *.1(GND) R10.2
Net*_2: *.2(SWD) R10.1 ; port SWDIO
Net*_3: *.3(SWO) R9.1 ; port SWCLK
Net*_4: *.4(RST) ; port RST

### Library data of the parts
* = SWD: pin to pad: 4>5 5>4
R9 R10 = CMP-13261-000953-1: as R14 on sheet STM32WB55CGU6; Tolerance: 1%; Height: 0.016inch; Length: 1mm; Case Code (Metric): 1005; Width: 0.02inch; Max Power Dissipation: 63mW; Radiation Hardening: No; Features: Moisture Resistant; Temperature Coefficient: 100ppm/°C; Min Operating Temperature: -55°C; Number of Terminations: 2; Max Operating Temperature: 155°C; Case Code (Imperial): 0402; Composition: Thick Film; Depth: 0.5mm; Lead Free: Lead Free; Package Quantity: 1; Case/Package: 0402; Packaging: Tape and Reel; Contact Plating: Tin; Military Standard: Not

## Nets that join several sheets
+3.3: STM32WB55CGU6 (22 pins), M24512-DFMC6TG (U2.1 U2.2 U2.8), LSM6DSRXTR (6 pins), LPS22HBTR (C8.2 U4.1 U4.6 U4.10), VIBRO (D5.1 V.2), LD3985M33R (C3.2 U1.5), TC58BVG1S3HBAI4 (IC22.H8 IC22.J6 R542.2), SWD (*.5 R9.2)
GND: STM32WB55CGU6 (27 pins), USB (D44.2 USB.A1-B12 USB.B1-A12 USB.GND), L6924D013TR (11 pins), M24512-DFMC6TG (U2.3 U2.4), LSM6DSRXTR (C9.1 C10.1 U5.6 U5.7), LPS22HBTR (5 pins), VIBRO (Q1.2 R11.2), LD3985M33R (C1.1 C2.1 C3.1 U1.2), TC58BVG1S3HBAI4 (C244.1 IC22.C5 IC22.K3 IC22.K8), SWD (*.1 R10.2)
VBAT: L6924D013TR (BAT.2 C4.2 U3.10 U3.11), LD3985M33R (C1.2 U1.1 U1.3)
VUSB: USB (D44.5 R8.2 USB.A4-B9 USB.B4-A9), L6924D013TR (5 pins)
Net*_2: STM32WB55CGU6 (U7.39), SWD (*.2 R10.1)
Net*_3: STM32WB55CGU6 (U7.41), SWD (*.3 R9.1)
Net*_4: STM32WB55CGU6 (D4.1), SWD (*.4)
NetC244_2: STM32WB55CGU6 (U7.17), TC58BVG1S3HBAI4 (C244.2 IC22.C8 R542.1)
NetD1_1: STM32WB55CGU6 (U7.19), L6924D013TR (D1.1 U3.3)
NetD2_1: STM32WB55CGU6 (U7.18), L6924D013TR (D2.1 U3.4)
NetD44_1: STM32WB55CGU6 (U7.37), USB (D44.1)
NetD44_3: STM32WB55CGU6 (U7.38), USB (D44.3)
NetIC22_C3: STM32WB55CGU6 (U7.29), TC58BVG1S3HBAI4 (IC22.C3)
NetIC22_C4: STM32WB55CGU6 (U7.43), TC58BVG1S3HBAI4 (IC22.C4)
NetIC22_C6: STM32WB55CGU6 (U7.44), TC58BVG1S3HBAI4 (IC22.C6)
NetIC22_C7: STM32WB55CGU6 (U7.45), TC58BVG1S3HBAI4 (IC22.C7)
NetIC22_D4: STM32WB55CGU6 (U7.5), TC58BVG1S3HBAI4 (IC22.D4)
NetIC22_D5: STM32WB55CGU6 (U7.6), TC58BVG1S3HBAI4 (IC22.D5)
NetIC22_H4: STM32WB55CGU6 (U7.9), TC58BVG1S3HBAI4 (IC22.H4)
NetIC22_J4: STM32WB55CGU6 (U7.10), TC58BVG1S3HBAI4 (IC22.J4)
NetIC22_J7: STM32WB55CGU6 (U7.14), TC58BVG1S3HBAI4 (IC22.J7)
NetIC22_J8: STM32WB55CGU6 (U7.16), TC58BVG1S3HBAI4 (IC22.J8)
NetIC22_K4: STM32WB55CGU6 (U7.11), TC58BVG1S3HBAI4 (IC22.K4)
NetIC22_K5: STM32WB55CGU6 (U7.12), TC58BVG1S3HBAI4 (IC22.K5)
NetIC22_K6: STM32WB55CGU6 (U7.13), TC58BVG1S3HBAI4 (IC22.K6)
NetIC22_K7: STM32WB55CGU6 (U7.15), TC58BVG1S3HBAI4 (IC22.K7)
NetR2_1: STM32WB55CGU6 (U7.42), L6924D013TR (R2.1 U3.13)
NetR12_2: STM32WB55CGU6 (U7.36), VIBRO (R12.2)
NetR15_1: STM32WB55CGU6 (R15.1 U7.46), M24512-DFMC6TG (U2.6), LSM6DSRXTR (U5.13), LPS22HBTR (U4.2)
NetR16_1: STM32WB55CGU6 (R16.1 U7.47), M24512-DFMC6TG (U2.5), LSM6DSRXTR (U5.14), LPS22HBTR (U4.4)
NetU2_7: STM32WB55CGU6 (U7.28), M24512-DFMC6TG (U2.7)